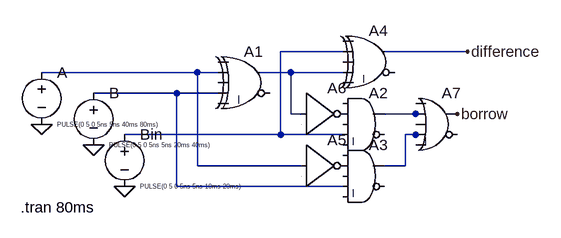
[diagram p0: schematic halfsubtractor.asc]
halfsubtractor.asc, the LTspice schematic file:
Version 4.1
SHEET 1 880 680
WIRE 304 128 208 128
WIRE 496 128 368 128
WIRE 80 160 -160 160
WIRE 112 160 80 160
WIRE 224 160 176 160
WIRE 304 160 224 160
WIRE 48 192 -80 192
WIRE 112 192 48 192
WIRE 224 224 224 160
WIRE 240 224 224 224
WIRE 416 224 368 224
WIRE 432 224 416 224
WIRE 208 256 208 128
WIRE 208 256 -32 256
WIRE 304 256 208 256
WIRE 416 256 400 256
WIRE 432 256 416 256
WIRE 80 304 80 160
WIRE 240 304 80 304
WIRE 400 304 400 256
WIRE 400 304 368 304
WIRE 48 336 48 192
WIRE 304 336 48 336
FLAG -32 336 0
FLAG -80 272 0
FLAG -160 240 0
FLAG 496 128 difference
FLAG 480 224 borrow
SYMBOL Digital\\xor 160 112 R0
SYMATTR InstName A1
SYMBOL Digital\\and 336 176 R0
SYMATTR InstName A2
SYMBOL Digital\\and 336 256 R0
SYMATTR InstName A3
SYMBOL Digital\\xor 352 80 R0
SYMATTR InstName A4
SYMBOL Digital\\inv 240 240 R0
SYMATTR InstName A5
SYMBOL Digital\\inv 240 160 R0
SYMATTR InstName A6
SYMBOL voltage -32 240 R0
WINDOW 3 24 96 Left 0
WINDOW 123 0 0 Left 0
WINDOW 39 0 0 Left 0
SYMATTR InstName Bin
SYMATTR Value PULSE(0 5 0 5ns 5ns 10ms 20ms)
SYMBOL voltage -80 176 R0
WINDOW 3 24 96 Left 0
WINDOW 123 0 0 Left 0
WINDOW 39 0 0 Left 0
SYMATTR InstName B
SYMATTR Value PULSE(0 5 0 5ns 5ns 20ms 40ms)
SYMBOL voltage -160 144 R0
WINDOW 3 24 96 Left 0
WINDOW 123 0 0 Left 0
WINDOW 39 0 0 Left 0
SYMATTR InstName A
SYMATTR Value PULSE(0 5 0 5ns 5ns 40ms 80ms)
SYMBOL Digital\\or 448 176 R0
SYMATTR InstName A7
TEXT -192 368 Left 2 !.tran 80ms

The netlist it stands for:
* halfsubtractor.asc
A1 0 N002 0 N004 0 0 N003 0 XOR
A2 0 P001 0 N001 0 0 N005 0 AND
A3 0 P002 0 N004 0 0 N006 0 AND
A4 0 N001 0 N003 0 0 difference 0 XOR
A5 N002 0 0 0 0 P002 0 0 BUF
A6 N003 0 0 0 0 P001 0 0 BUF
V§Bin N001 0 PULSE(0 5 0 5ns 5ns 10ms 20ms)
V§B N004 0 PULSE(0 5 0 5ns 5ns 20ms 40ms)
V§A N002 0 PULSE(0 5 0 5ns 5ns 40ms 80ms)
A7 0 N005 0 N006 0 0 borrow 0 OR
.tran 80ms
.backanno
.end